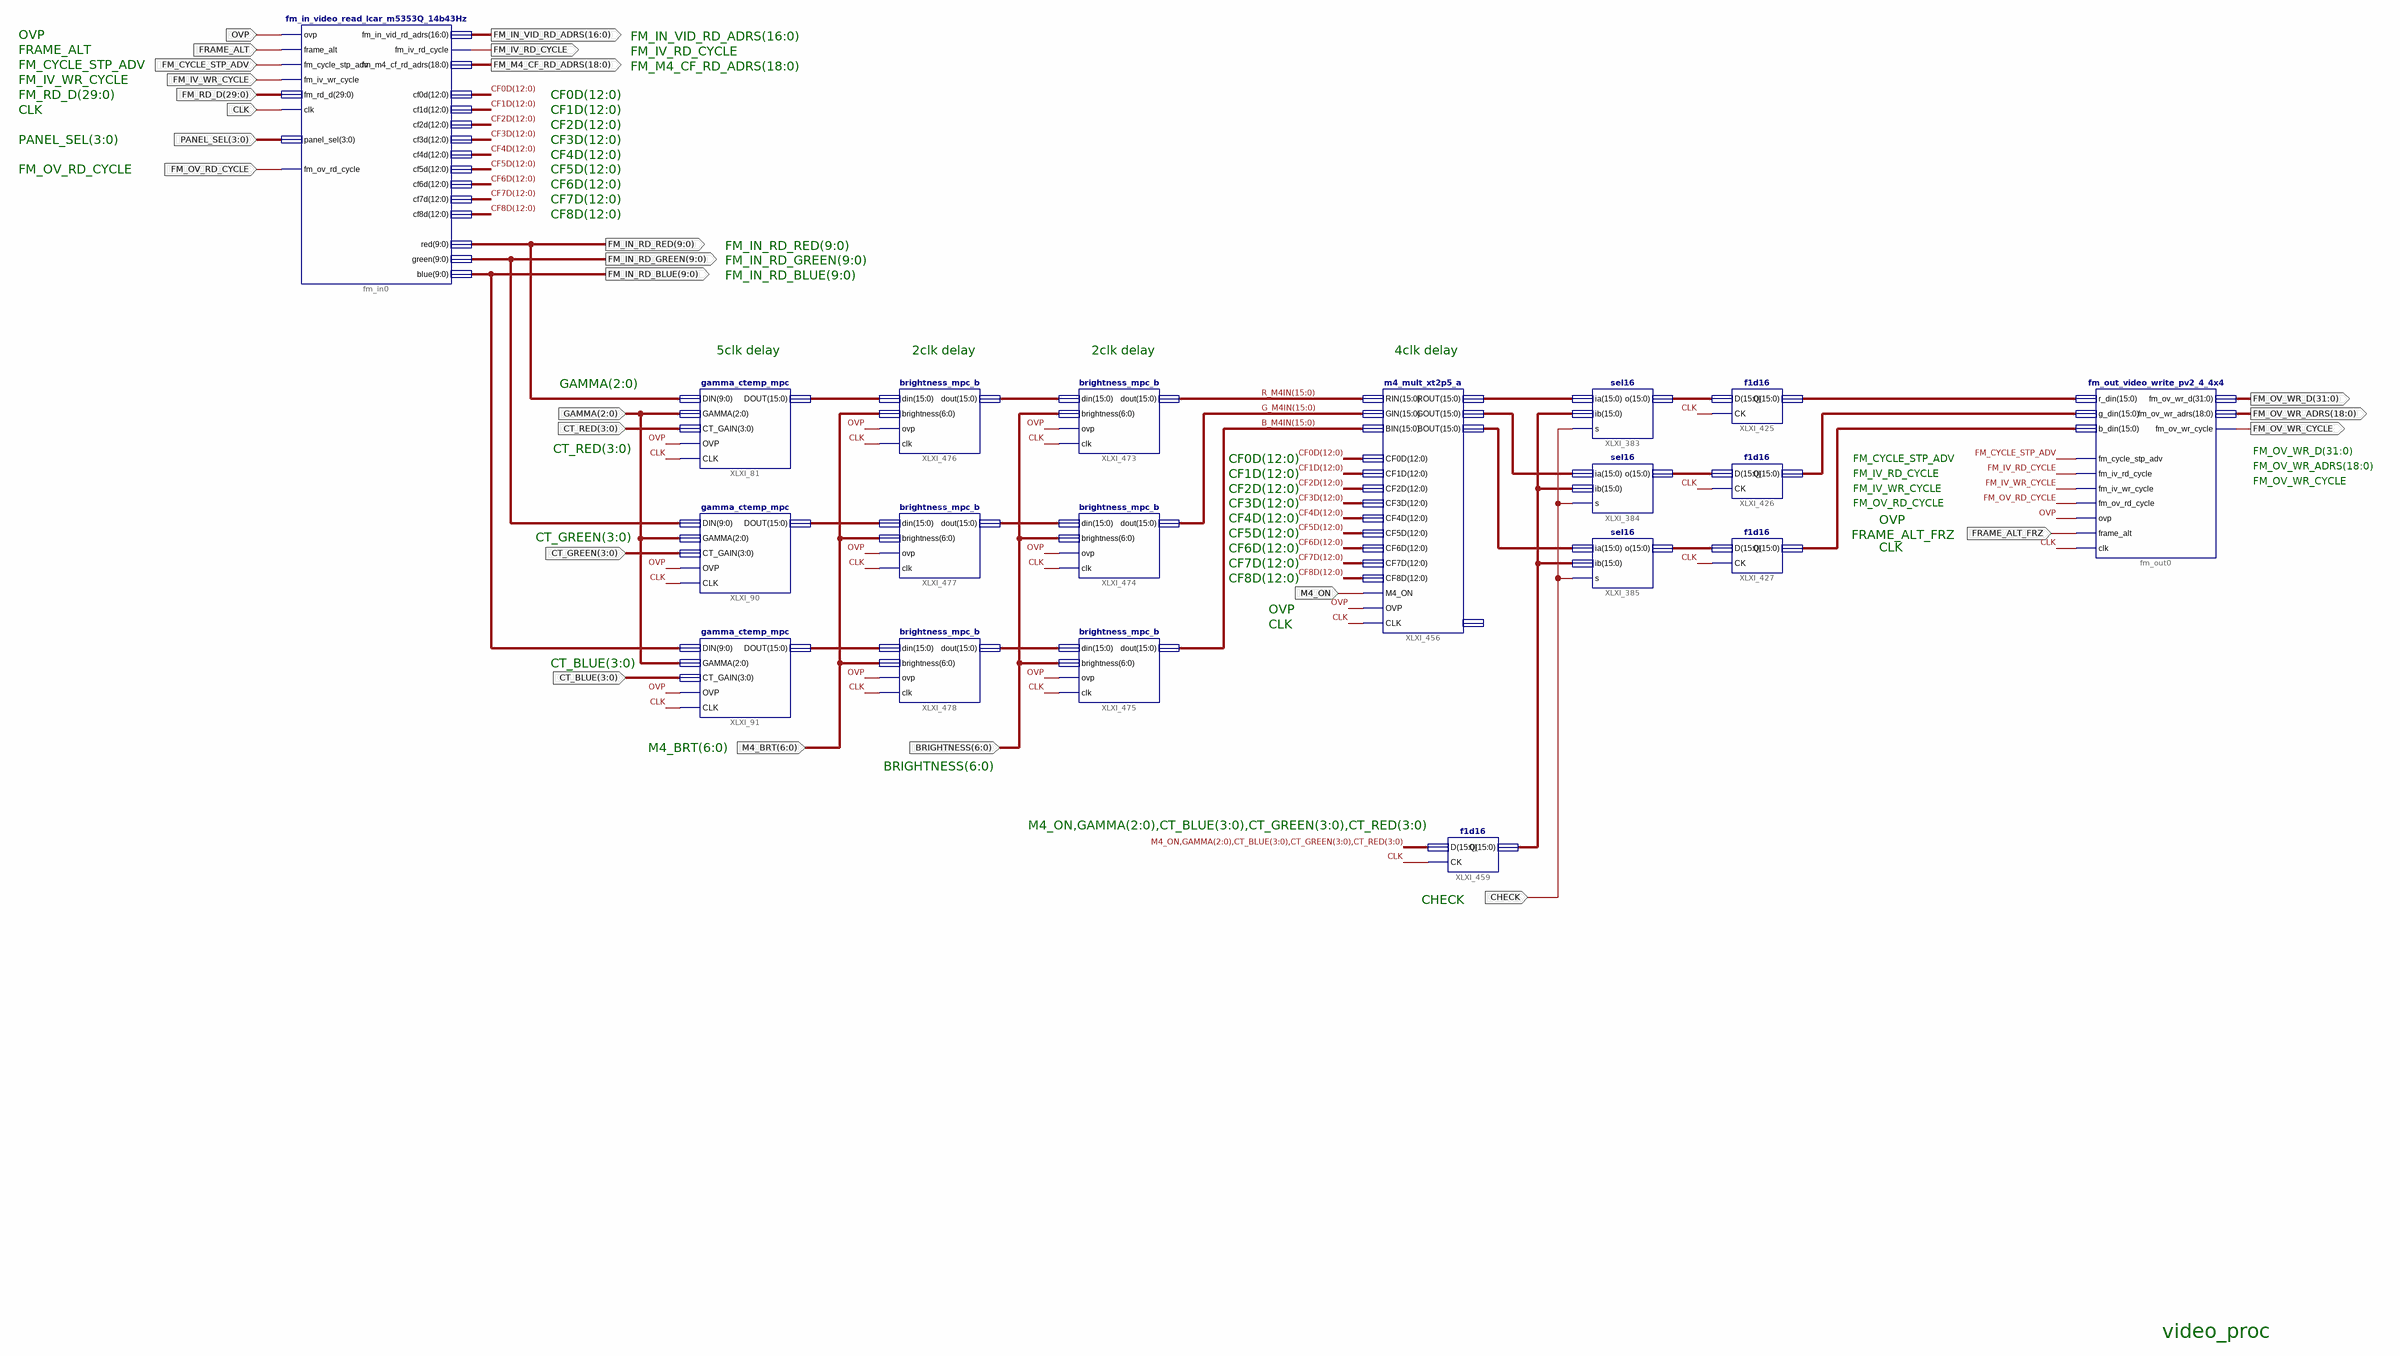
[diagram p0: schematic sheet 1]
// Xilinx ISE schematic video_proc.sch (aspartan6) as structural Verilog: 19 symbols, 26 ports
module video_proc (
  input  [2:0] GAMMA,
  input  [3:0] CT_RED,
  input  [3:0] CT_GREEN,
  input  [3:0] CT_BLUE,
  input  OVP,
  input  CLK,
  input  [6:0] M4_BRT,
  input  M4_ON,
  input  FM_CYCLE_STP_ADV,
  input  FM_IV_WR_CYCLE,
  input  FRAME_ALT,
  input  CHECK,
  input  [6:0] BRIGHTNESS,
  input  [29:0] FM_RD_D,
  input  [3:0] PANEL_SEL,
  input  FM_OV_RD_CYCLE,
  input  FRAME_ALT_FRZ,
  output [9:0] FM_IN_RD_RED,
  output [9:0] FM_IN_RD_GREEN,
  output [9:0] FM_IN_RD_BLUE,
  output [31:0] FM_OV_WR_D,
  output [18:0] FM_OV_WR_ADRS,
  output FM_OV_WR_CYCLE,
  output FM_IV_RD_CYCLE,
  output [16:0] FM_IN_VID_RD_ADRS,
  output [18:0] FM_M4_CF_RD_ADRS
);

  wire [12:0] CF0D, CF1D, CF2D, CF3D, CF4D, CF5D, CF6D, CF7D, CF8D;
  wire [15:0] B_M4IN, G_M4IN, R_M4IN, XLXN_1513, XLXN_1514, XLXN_1515, XLXN_1670, XLXN_1671, XLXN_1672,
       XLXN_1675, XLXN_1676, XLXN_1678, XLXN_1817, XLXN_1818, XLXN_1819, XLXN_2105, XLXN_2106, XLXN_2108,
       XLXN_2127;

  gamma_ctemp_mpc XLXI_81 (.DIN(FM_IN_RD_RED), .CT_GAIN(CT_RED), .GAMMA(GAMMA), .DOUT(XLXN_1513), .CLK(CLK), .OVP(OVP));
  gamma_ctemp_mpc XLXI_90 (
    .DIN(FM_IN_RD_GREEN), .CT_GAIN(CT_GREEN), .GAMMA(GAMMA), .DOUT(XLXN_1514), .CLK(CLK), .OVP(OVP));
  gamma_ctemp_mpc XLXI_91 (
    .DIN(FM_IN_RD_BLUE), .CT_GAIN(CT_BLUE), .GAMMA(GAMMA), .DOUT(XLXN_1515), .CLK(CLK), .OVP(OVP));
  sel16 XLXI_383 (.s(CHECK), .ia(XLXN_1675), .ib(XLXN_2127), .o(XLXN_1817));
  sel16 XLXI_384 (.s(CHECK), .ia(XLXN_1678), .ib(XLXN_2127), .o(XLXN_1818));
  sel16 XLXI_385 (.s(CHECK), .ia(XLXN_1676), .ib(XLXN_2127), .o(XLXN_1819));
  f1d16 XLXI_425 (.D(XLXN_1817), .CK(CLK), .Q(XLXN_2105));
  f1d16 XLXI_427 (.D(XLXN_1819), .CK(CLK), .Q(XLXN_2108));
  f1d16 XLXI_426 (.D(XLXN_1818), .CK(CLK), .Q(XLXN_2106));
  m4_mult_xt2p5_a XLXI_456 (
    .CF0D(CF0D), .CF4D(CF4D), .RIN(R_M4IN), .GIN(G_M4IN), .CF8D(CF8D), .BIN(B_M4IN), .M4_ON(M4_ON),
    .CF1D(CF1D), .CF2D(CF2D), .CF3D(CF3D), .CF5D(CF5D), .CF6D(CF6D), .CF7D(CF7D), .ROUT(XLXN_1675),
    .GOUT(XLXN_1678), .BOUT(XLXN_1676), .CLK(CLK), .OVP(OVP));  // open: BR
  f1d16 XLXI_459 (.D({M4_ON, GAMMA, CT_BLUE, CT_GREEN, CT_RED}), .CK(CLK), .Q(XLXN_2127));
  fm_out_video_write_pv2_4_4x4 fm_out0 (
    .fm_cycle_stp_adv(FM_CYCLE_STP_ADV), .fm_iv_rd_cycle(FM_IV_RD_CYCLE), .fm_iv_wr_cycle(FM_IV_WR_CYCLE),
    .r_din(XLXN_2105), .g_din(XLXN_2106), .b_din(XLXN_2108), .fm_ov_wr_cycle(FM_OV_WR_CYCLE),
    .fm_ov_wr_adrs(FM_OV_WR_ADRS), .fm_ov_wr_d(FM_OV_WR_D), .ovp(OVP), .fm_ov_rd_cycle(FM_OV_RD_CYCLE),
    .clk(CLK), .frame_alt(FRAME_ALT_FRZ));
  brightness_mpc_b XLXI_473 (.ovp(OVP), .clk(CLK), .din(XLXN_1670), .brightness(BRIGHTNESS), .dout(R_M4IN));
  brightness_mpc_b XLXI_474 (.ovp(OVP), .clk(CLK), .din(XLXN_1671), .brightness(BRIGHTNESS), .dout(G_M4IN));
  brightness_mpc_b XLXI_475 (.ovp(OVP), .clk(CLK), .din(XLXN_1672), .brightness(BRIGHTNESS), .dout(B_M4IN));
  brightness_mpc_b XLXI_476 (.ovp(OVP), .clk(CLK), .din(XLXN_1513), .brightness(M4_BRT), .dout(XLXN_1670));
  brightness_mpc_b XLXI_477 (.ovp(OVP), .clk(CLK), .din(XLXN_1514), .brightness(M4_BRT), .dout(XLXN_1671));
  brightness_mpc_b XLXI_478 (.ovp(OVP), .clk(CLK), .din(XLXN_1515), .brightness(M4_BRT), .dout(XLXN_1672));
  fm_in_video_read_lcar_m5353Q_14b43Hz fm_in0 (
    .clk(CLK), .fm_cycle_stp_adv(FM_CYCLE_STP_ADV), .fm_iv_wr_cycle(FM_IV_WR_CYCLE),
    .fm_ov_rd_cycle(FM_OV_RD_CYCLE), .fm_rd_d(FM_RD_D), .frame_alt(FRAME_ALT), .ovp(OVP),
    .panel_sel(PANEL_SEL), .blue(FM_IN_RD_BLUE), .cf0d(CF0D), .cf1d(CF1D), .cf2d(CF2D), .cf3d(CF3D),
    .cf4d(CF4D), .cf5d(CF5D), .cf6d(CF6D), .cf7d(CF7D), .cf8d(CF8D), .fm_in_vid_rd_adrs(FM_IN_VID_RD_ADRS),
    .fm_iv_rd_cycle(FM_IV_RD_CYCLE), .fm_m4_cf_rd_adrs(FM_M4_CF_RD_ADRS), .green(FM_IN_RD_GREEN),
    .red(FM_IN_RD_RED));

  // Notes on the sheet:
  //   OVP
  //   FM_IN_VID_RD_ADRS(16:0)
  //   FRAME_ALT
  //   FM_IV_RD_CYCLE
  //   FM_CYCLE_STP_ADV
  //   FM_M4_CF_RD_ADRS(18:0)
  //   FM_IV_WR_CYCLE
  //   FM_RD_D(29:0)
  //   CF0D(12:0)
  //   CLK
  //   CF1D(12:0)
  //   CF2D(12:0)
  //   PANEL_SEL(3:0)
  //   CF3D(12:0)
  //   CF4D(12:0)
  //   FM_OV_RD_CYCLE
  //   CF5D(12:0)
  //   CF6D(12:0)
  //   CF7D(12:0)
  //   CF8D(12:0)
  //   FM_IN_RD_RED(9:0)
  //   FM_IN_RD_GREEN(9:0)
  //   FM_IN_RD_BLUE(9:0)
  //   5clk delay
  //   2clk delay
  //   2clk delay
  //   4clk delay
  //   GAMMA(2:0)
  //   CT_RED(3:0)
  //   FM_OV_WR_D(31:0)
  //   CF0D(12:0)
  //   FM_CYCLE_STP_ADV
  //   FM_OV_WR_ADRS(18:0)
  //   CF1D(12:0)
  //   FM_IV_RD_CYCLE
  //   FM_OV_WR_CYCLE
  //   CF2D(12:0)
  //   FM_IV_WR_CYCLE
  //   CF3D(12:0)
  //   FM_OV_RD_CYCLE
  //   CF4D(12:0)
  //   OVP
  //   CF5D(12:0)
  //   FRAME_ALT_FRZ
  //   CT_GREEN(3:0)
  //   CLK
  //   CF6D(12:0)
  //   CF7D(12:0)
  //   CF8D(12:0)
  //   OVP
  //   CLK
  //   CT_BLUE(3:0)
  //   M4_BRT(6:0)
  //   BRIGHTNESS(6:0)
  //   M4_ON,GAMMA(2:0),CT_BLUE(3:0),CT_GREEN(3:0),CT_RED(3:0)
  //   CHECK
  //   video_proc
endmodule
